# EAGLE design temp_display (EAGLE 6.2)
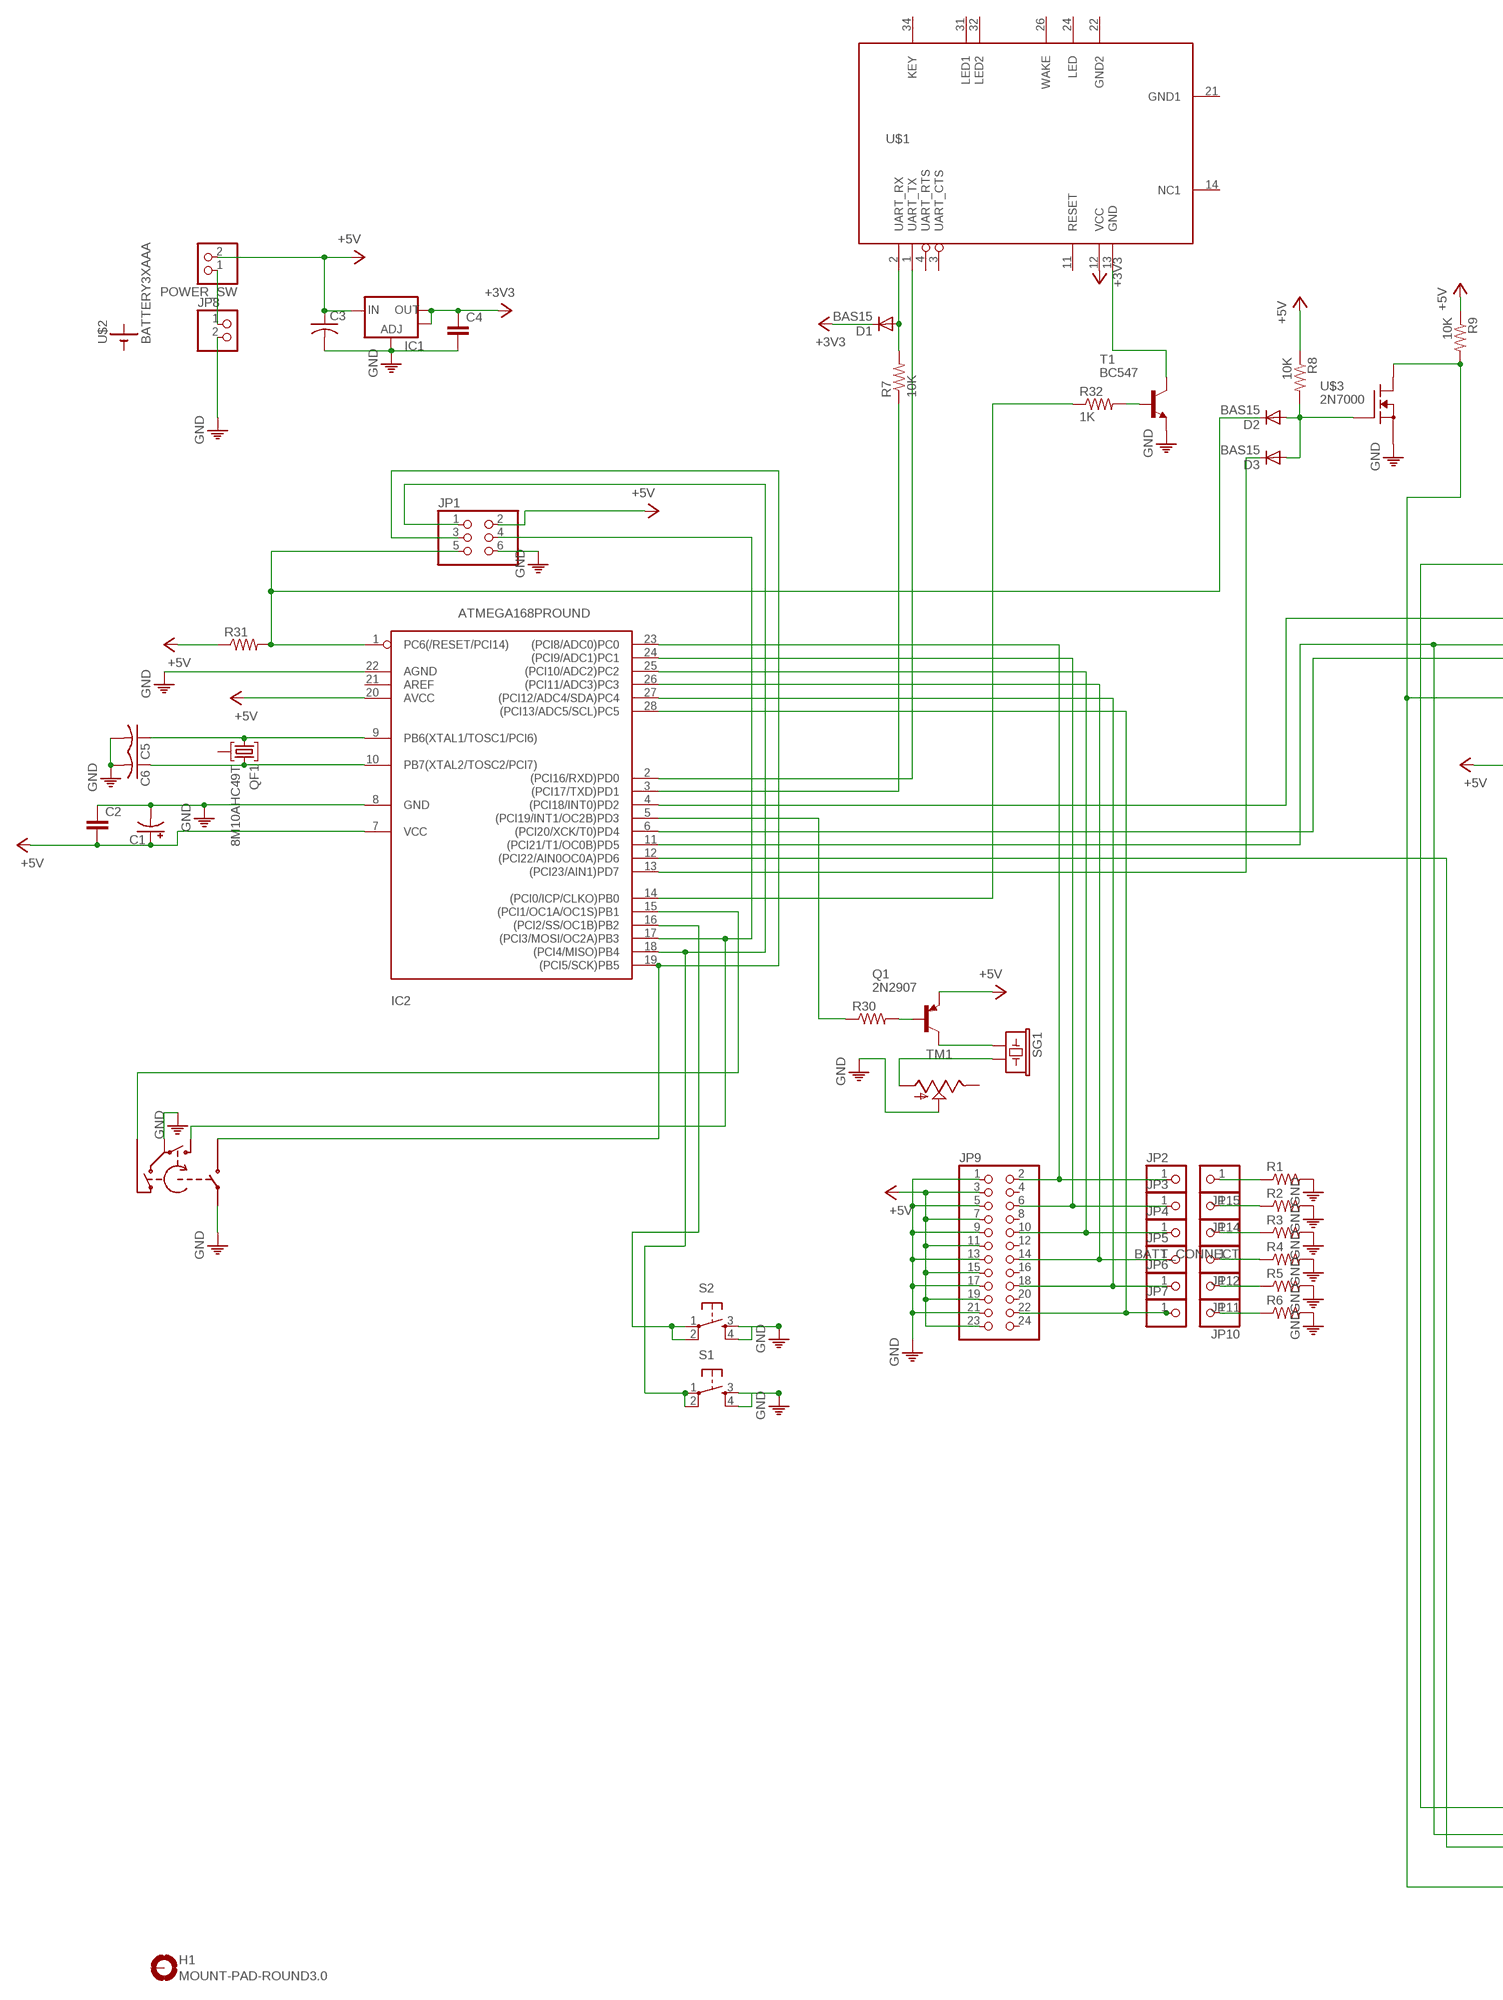
[diagram p0: schematic, sheet 1, part 1 of 2]
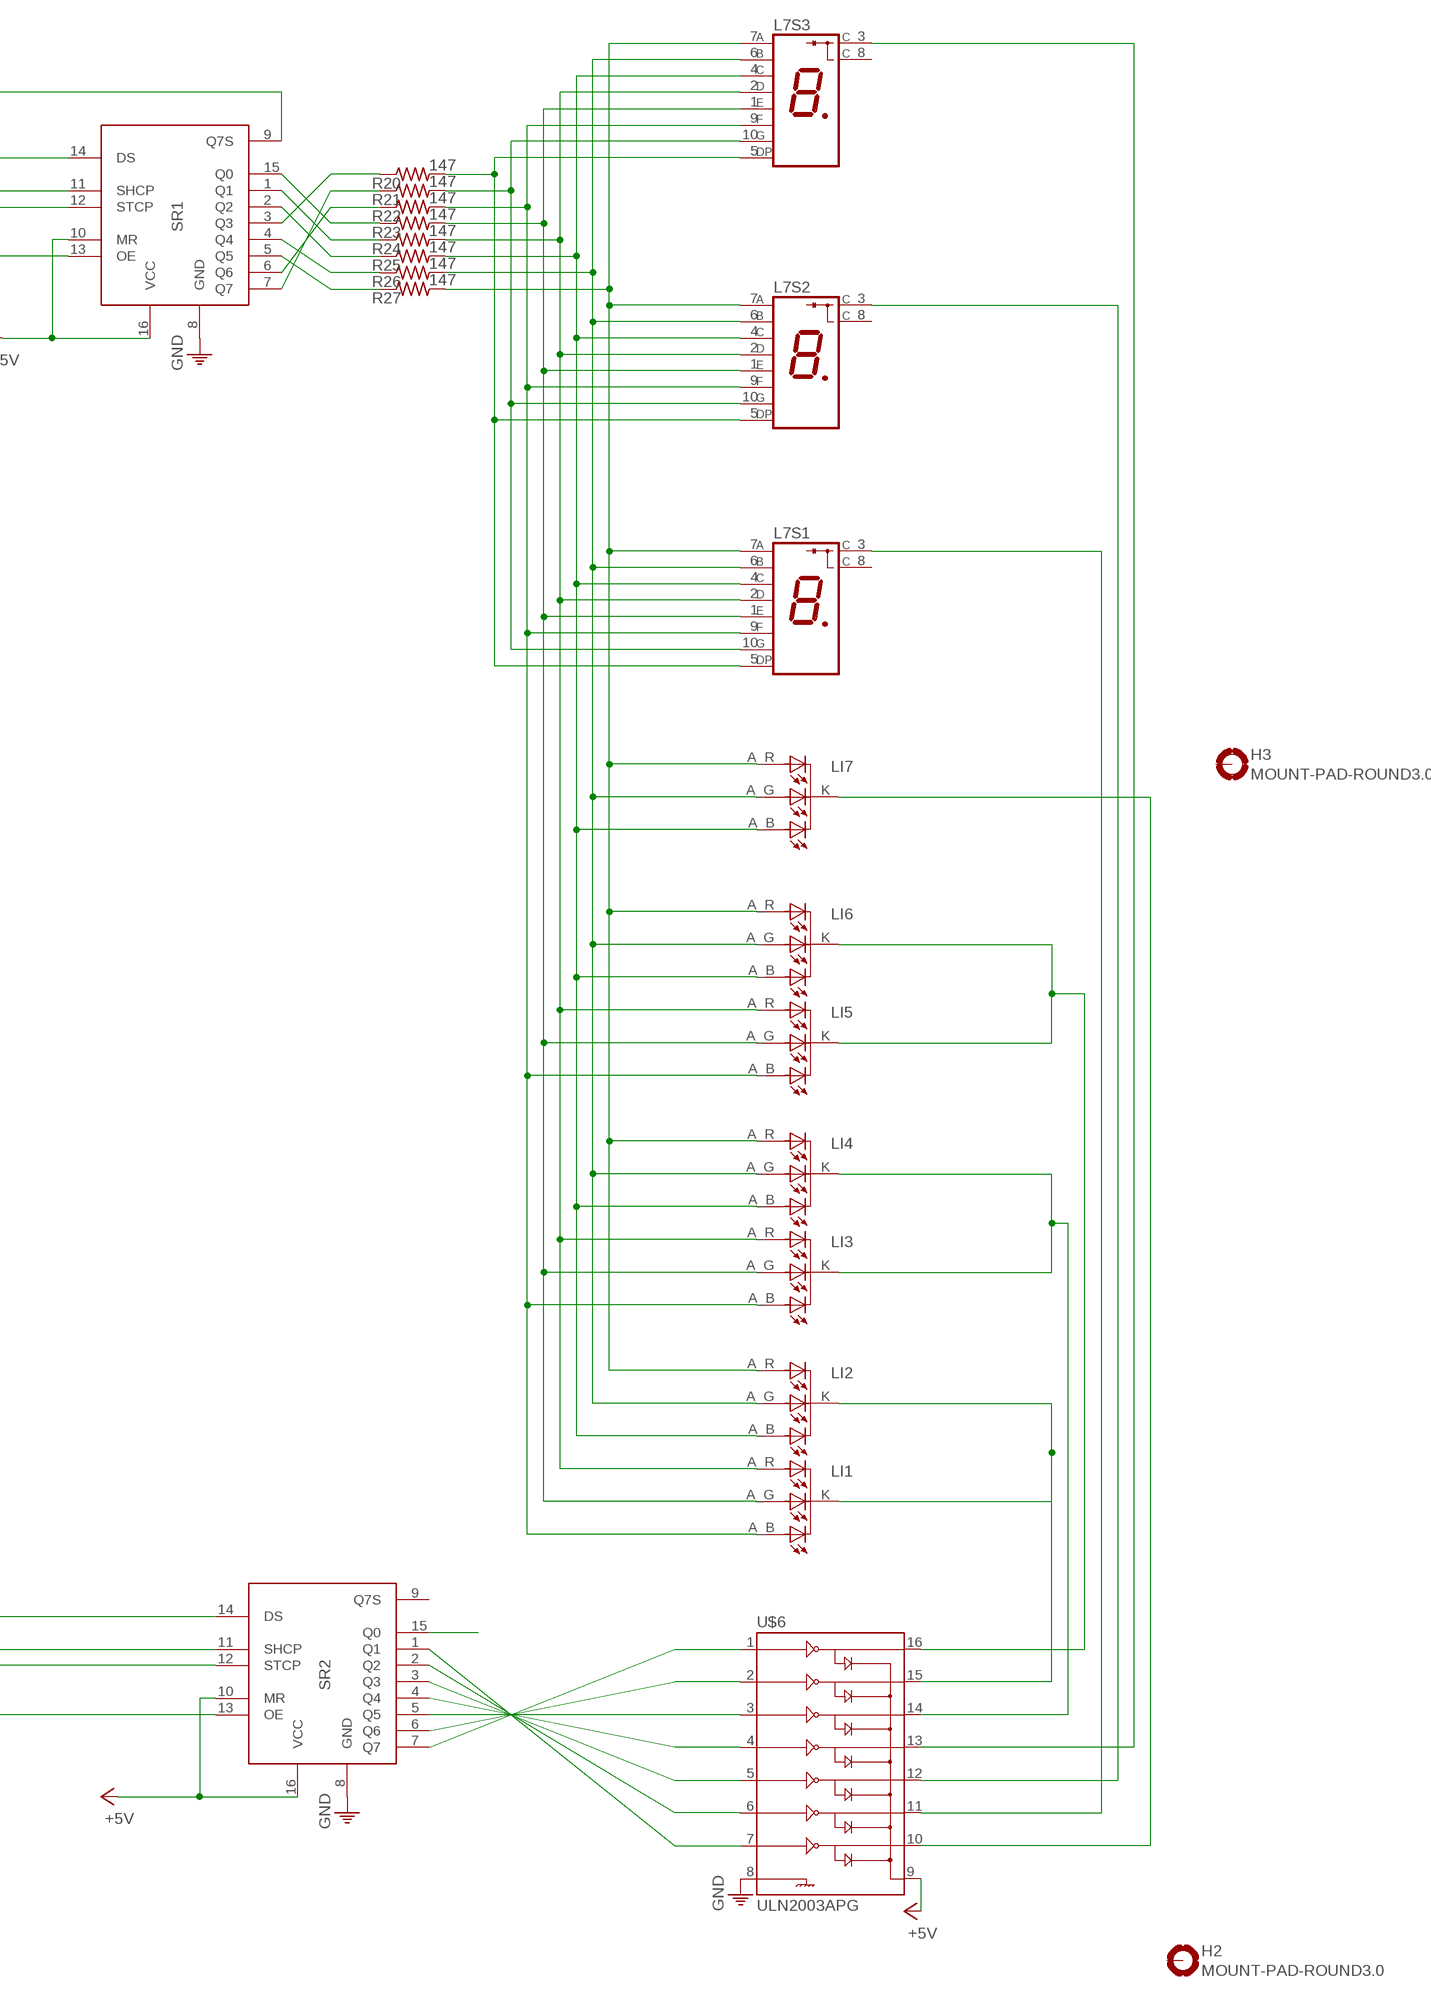
[diagram p1: schematic, sheet 1, part 2 of 2]

## Parts
BATT_CONNECT  PINHD-1X1  [1X01]
C1  CPOL-USE2.5-5  [E2,5-5]
C2  CAPPTH1  [CAP-PTH-5MM]
C3  C-US050-025X075  [C050-025X075]
C4  CAPSMD  [GRM43D]
C5  C-US025-024X044  [C025-024X044]
C6  C-US025-024X044  [C025-024X044]
D1  BAS15  [DO34-7]
D2  BAS15  [DO34-7]
D3  BAS15  [DO34-7]
H1  MOUNT-PAD-ROUND3.0  [3,0-PAD]
H2  MOUNT-PAD-ROUND3.0  [3,0-PAD]
H3  MOUNT-PAD-ROUND3.0  [3,0-PAD]
IC1  V_REG_LM1117SOT223  [SOT223]
IC2  ATMEGA168PROUND  [DIL28-3-ROUND]
JP1  PINHD-2X3  [2X03]
JP2  PINHD-1X1  [1X01]
JP3  PINHD-1X1  [1X01]
JP4  PINHD-1X1  [1X01]
JP5  PINHD-1X1  [1X01]
JP6  PINHD-1X1  [1X01]
JP7  PINHD-1X1  [1X01]
JP8  PINHD-1X2  [1X02]
JP9  PINHD-2X12  [2X12]
JP10  PINHD-1X1  [1X01]
JP11  PINHD-1X1  [1X01]
JP12  PINHD-1X1  [1X01]
JP14  PINHD-1X1  [1X01]
JP15  PINHD-1X1  [1X01]
L7S1  7-SEGMENT_LED_CCED_C.BA_FG  [7-SEGMENT_LED]
L7S2  7-SEGMENT_LED_CCED_C.BA_FG  [7-SEGMENT_LED]
L7S3  7-SEGMENT_LED_CCED_C.BA_FG  [7-SEGMENT_LED]
LI1  LED_RGB_CC  [LED_RGB_5MM_]
LI2  LED_RGB_CC  [LED_RGB_5MM_]
LI3  LED_RGB_CC  [LED_RGB_5MM_]
LI4  LED_RGB_CC  [LED_RGB_5MM_]
LI5  LED_RGB_CC  [LED_RGB_5MM_]
LI6  LED_RGB_CC  [LED_RGB_5MM_]
LI7  LED_RGB_CC  [LED_RGB_5MM_]
POWER_SW  PINHD-1X2  [1X02]
Q1  2N2907  [TO92-EBC-OVAL]
QF1  8M10AHC49T  [HC49U]
R1  R-USR_POWER-15X8.5  [R_POWER-15X8.5]
R2  R-USR_POWER-15X8.5  [R_POWER-15X8.5]
R3  R-USR_POWER-15X8.5  [R_POWER-15X8.5]
R4  R-USR_POWER-15X8.5  [R_POWER-15X8.5]
R5  R-USR_POWER-15X8.5  [R_POWER-15X8.5]
R6  R-USR_POWER-15X8.5  [R_POWER-15X8.5]
R7  10K  R-US_0204/7  [0204/7]
R8  10K  R-US_0204/2V  [0204V]
R9  10K  R-US_0204/2V  [0204V]
R20  147  R-US_0204/7  [0204/7]
R21  147  R-US_0204/7  [0204/7]
R22  147  R-US_0204/7  [0204/7]
R23  147  R-US_0204/7  [0204/7]
R24  147  R-US_0204/7  [0204/7]
R25  147  R-US_0204/7  [0204/7]
R26  147  R-US_0204/7  [0204/7]
R27  147  R-US_0204/7  [0204/7]
R30  R-US_0204/2V  [0204V]
R31  R-US_0204/5  [0204/5]
R32  1K  R-US_0204/7  [0204/7]
S1  TAC_SWITCHPTH  [TACTILE-PTH]
S2  TAC_SWITCHPTH  [TACTILE-PTH]
SG1  BUZZERPTH  [BUZZER-12MM]
SR1  74HC595  [DIL16]
SR2  74HC595  [DIL16]
T1  BC547  [TO92]
TM1  TRIMPOT  [TRIMPOT_A]
U$1  BLUETOOTH_MODULE_DX_FEWPADS  [BLUETOOTH_MODULE_DX_FEW_PADS]
U$2  BATTERY3XAAA  [BATTERY_HOLDER_3XAAA]
U$3  2N7000  [TO-92]
U$5  ALPHA-ROT-ENCODER  [TW-700198]
U$6  ULN2003APG  [DIL16]

## Nets
+3V3: C4.A D1.C IC1.2(OUT) IC1.4(OUT) U$1.12(VCC)
+5V: C1.+ C2.2 C3.1 IC1.3(IN) IC2.7(VCC) IC2.20(AVCC) JP1.2 JP9.3 JP9.7 JP9.11 JP9.15 JP9.19 JP9.23 POWER_SW.2 Q1.E R8.1 R9.1 R31.1 SR1.10(MR) SR1.16(VCC) SR2.10(MR) SR2.16(VCC) U$6.9
ADC0: IC2.23((PCI8/ADC0)PC0) JP2.1 JP9.2
ADC1: IC2.24((PCI9/ADC1)PC1) JP3.1 JP9.6
ADC2: IC2.25((PCI10/ADC2)PC2) JP4.1 JP9.10
ADC3: IC2.26((PCI11/ADC3)PC3) JP5.1 JP9.14
ADC4: IC2.27((PCI12/ADC4/SDA)PC4) JP6.1 JP9.18
ADC5: IC2.28((PCI13/ADC5/SCL)PC5) JP7.1 JP9.22
BTH_PW_TRANS: IC2.14((PCI0/ICP/CLKO)PB0) R32.1
CAT_1: SR2.1(Q1) U$6.7
CAT_2: SR2.2(Q2) U$6.6
CAT_3: SR2.3(Q3) U$6.5
CAT_4: SR2.4(Q4) U$6.4
CAT_5: SR2.5(Q5) U$6.3
CAT_6: SR2.6(Q6) U$6.2
CAT_7: SR2.7(Q7) U$6.1
DS: IC2.4((PCI18/INT0)PD2) SR1.14(DS)
GND: C1.- C2.1 C3.2 C4.C C5.2 C6.2 IC1.1(ADJ) IC2.8(GND) IC2.22(AGND) JP1.6 JP8.2 JP9.1 JP9.5 JP9.9 JP9.13 JP9.17 JP9.21 R1.P$2 R2.P$2 R3.P$2 R4.P$2 R5.P$2 R6.P$2 S1.3 S1.4 S2.3 S2.4 SR1.8(GND) SR2.8(GND) T1.1(E) TM1.S U$3.1(S) U$5.P2(COM) U$5.P4(S1) U$6.8
K_IL12: LI1.K LI2.K U$6.15
K_IL34: LI3.K LI4.K U$6.14
K_IL567: LI5.K LI6.K U$6.16
K_L7S_1: L7S1.3(C) U$6.11
K_L7S_2: L7S2.3(C) U$6.12
K_L7S_3: L7S3.3(C) U$6.13
MROUTE: IC2.19((PCI5/SCK)PB5) JP1.3 U$5.P5(S2)
N$1: SR1.9(Q7S) SR2.14(DS)
N$2: R32.2 T1.2(B)
N$3: T1.3(C) U$1.13(GND)
N$4: D1.A R7.2 U$1.2(UART_RX)
N$5: IC2.16((PCI2/SS/OC1B)PB2) S2.1 S2.2
N$6: SG1.- TM1.A
N$7: LI7.K U$6.10
N$9: SR2.15(Q0)
N$10: IC2.5((PCI19/INT1/OC2B)PD3) R30.1
N$11: C5.1 IC2.9(PB6(XTAL1/TOSC1/PCI6)) QF1.1
N$12: C6.1 IC2.10(PB7(XTAL2/TOSC2/PCI7)) QF1.3
N$13: D3.C IC2.13((PCI23/AIN1)PD7)
N$14: D2.A D3.A R8.2 U$3.2(G)
N$15: R20.1 SR1.3(Q3)
N$16: JP8.1 POWER_SW.1
N$18: R26.1 SR1.4(Q4)
N$22: R25.1 SR1.2(Q2)
N$23: JP15.1 R1.P$1
N$24: JP14.1 R2.P$1
N$25: R24.1 SR1.1(Q1)
N$26: R23.1 SR1.15(Q0)
N$27: IC2.18((PCI4/MISO)PB4) JP1.1 S1.1 S1.2
N$31: IC2.17((PCI3/MOSI/OC2A)PB3) JP1.4 U$5.P1(B)
N$35: BATT_CONNECT.1 R3.P$1
N$36: JP12.1 R4.P$1
N$37: JP11.1 R5.P$1
N$38: JP10.1 R6.P$1
N$40: R27.1 SR1.5(Q5)
N$41: IC2.15((PCI1/OC1A/OC1S)PB1) U$5.P3(A)
N$42: R21.1 SR1.7(Q7)
N$44: R22.1 SR1.6(Q6)
N$51: Q1.B R30.2
N$52: Q1.C SG1.+
OE: R9.2 SR1.13(OE) SR2.13(OE) U$3.3(D)
RESET: D2.C IC2.1(PC6(/RESET/PCI14)) JP1.5 R31.2
SEG_A: L7S1.7(SEG_A) L7S2.7(SEG_A) L7S3.7(SEG_A) LI2.A_R(R) LI4.A_R(R) LI6.A_R(R) LI7.A_R(R) R27.2
SEG_B: L7S1.6(SEG_B) L7S2.6(SEG_B) L7S3.6(SEG_B) LI2.A_G(G) LI4.A_G(G) LI6.A_G(G) LI7.A_G(G) R26.2
SEG_C: L7S1.4(SEG_C) L7S2.4(SEG_C) L7S3.4(SEG_C) LI2.A_B(B) LI4.A_B(B) LI6.A_B(B) LI7.A_B(B) R25.2
SEG_D: L7S1.2(SEG_D) L7S2.2(SEG_D) L7S3.2(SEG_D) LI1.A_R(R) LI3.A_R(R) LI5.A_R(R) R24.2
SEG_DP: L7S1.5(SEG_DP) L7S2.5(SEG_DP) L7S3.5(SEG_DP) R20.2
SEG_E: L7S1.1(SEG_E) L7S2.1(SEG_E) L7S3.1(SEG_E) LI1.A_G(G) LI3.A_G(G) LI5.A_G(G) R23.2
SEG_F: L7S1.9(SEG_F) L7S2.9(SEG_F) L7S3.9(SEG_F) LI1.A_B(B) LI3.A_B(B) LI5.A_B(B) R22.2
SEG_G: L7S1.10(SEG_G) L7S2.10(SEG_G) L7S3.10(SEG_G) R21.2
SERIAL_RX: IC2.3((PCI17/TXD)PD1) R7.1
SERIAL_TX: IC2.2((PCI16/RXD)PD0) U$1.1(UART_TX)
SHCP: IC2.11((PCI21/T1/OC0B)PD5) SR1.11(SHCP) SR2.11(SHCP)
STCP1: IC2.6((PCI20/XCK/T0)PD4) SR1.12(STCP)
STCP2: IC2.12((PCI22/AIN0OC0A)PD6) SR2.12(STCP)
Unconnected: H1.B3,0(MOUNT) H2.B3,0(MOUNT) H3.B3,0(MOUNT) IC2.21(AREF) JP9.4 JP9.8 JP9.12 JP9.16 JP9.20 JP9.24 L7S1.8(C) L7S2.8(C) L7S3.8(C) QF1.2 SR2.9(Q7S) TM1.E U$1.3(UART_CTS) U$1.4(UART_RTS) U$1.11(RESET) U$1.14(NC1) U$1.24(LED) U$1.26(WAKE) U$1.31(LED1) U$1.32(LED2) U$1.34(KEY)

## Power pins joined to a net without a drawn wire
GND1: U$1.21(GND1)
GND2: U$1.22(GND2)

## Library data of the parts
BATT_CONNECT JP2-JP7 JP10-JP12 JP14 JP15 = adafruit:PINHD-1X1: Pin header 1x1 for 0.1" spacing With round pins
C1 = adafruit:CPOL-US: POLARIZED CAPACITOR, American symbol
C2 C4 = SparkFun:CAP: Capacitor Standard 0603 ceramic capacitor, and 0.1" leaded capacitor.
C3 = adafruit:C-US: CAPACITOR, American symbol
C5 C6 = resistor:C-US: CAPACITOR, American symbol
D1-D3 = diode:BAS15: DIODE high speed
H1-H3 = holes:MOUNT-PAD-ROUND: MOUNTING PAD, round
IC1 = SparkFun:V_REG_LM1117: Voltage Regulator LM1117 Standard adjustable voltage regulator but in SMD form. Spark Fun Electronics SKU : COM-00595
IC2 = adafruit:ATMEGA168*P: MICROCONTROLLER 16 kBytes FLASH 1 kBytes SRAM 512 Bytes EEPROM USART 8-channel 10 bit ADC
JP1 = pinhead:PINHD-2X3: PIN HEADER
JP8 POWER_SW = pinhead:PINHD-1X2: PIN HEADER
JP9 = pinhead:PINHD-2X12: PIN HEADER
L7S1-L7S3 = kirill:7-SEGMENT_LED_CC
LI1-LI7 = kirill:LED_RGB_CC
Q1 = adafruit:2N2907*: PNP Transistor Big Oval pads
QF1 = crystal:8M10AHC49T: Monolithic Crystal Filters Source: www.vanlong.com; OC_FARNELL: unknown; OC_NEWARK: unknown
R1-R6 = kirill:R-US
R7-R9 R20-R27 R30-R32 = resistor:R-US_: RESISTOR, American symbol
S1 S2 = SparkFun:TAC_SWITCH: Momentary Switch Button commonly used for reset or general input. Spark Fun Electronics SKU : COM-00097
SG1 = SparkFun:BUZZER: Buzzer 12mm Spark Fun Electronics SKU : Comp-Buzzer
SR1 SR2 = kirill:74HC595
T1 = transistor:BC547: NPN TRANSISTOR
TM1 = kirill:TRIMPOT
U$1 = kirill:BLUETOOTH_MODULE_DX_FEWPADS
U$2 = kirill:BATTERY
U$3 = kirill:2N7000
U$5 = RotaryEncoder:ALPHA-ROT-ENCODER
U$6 = kirill:ULN2003APG

## Board
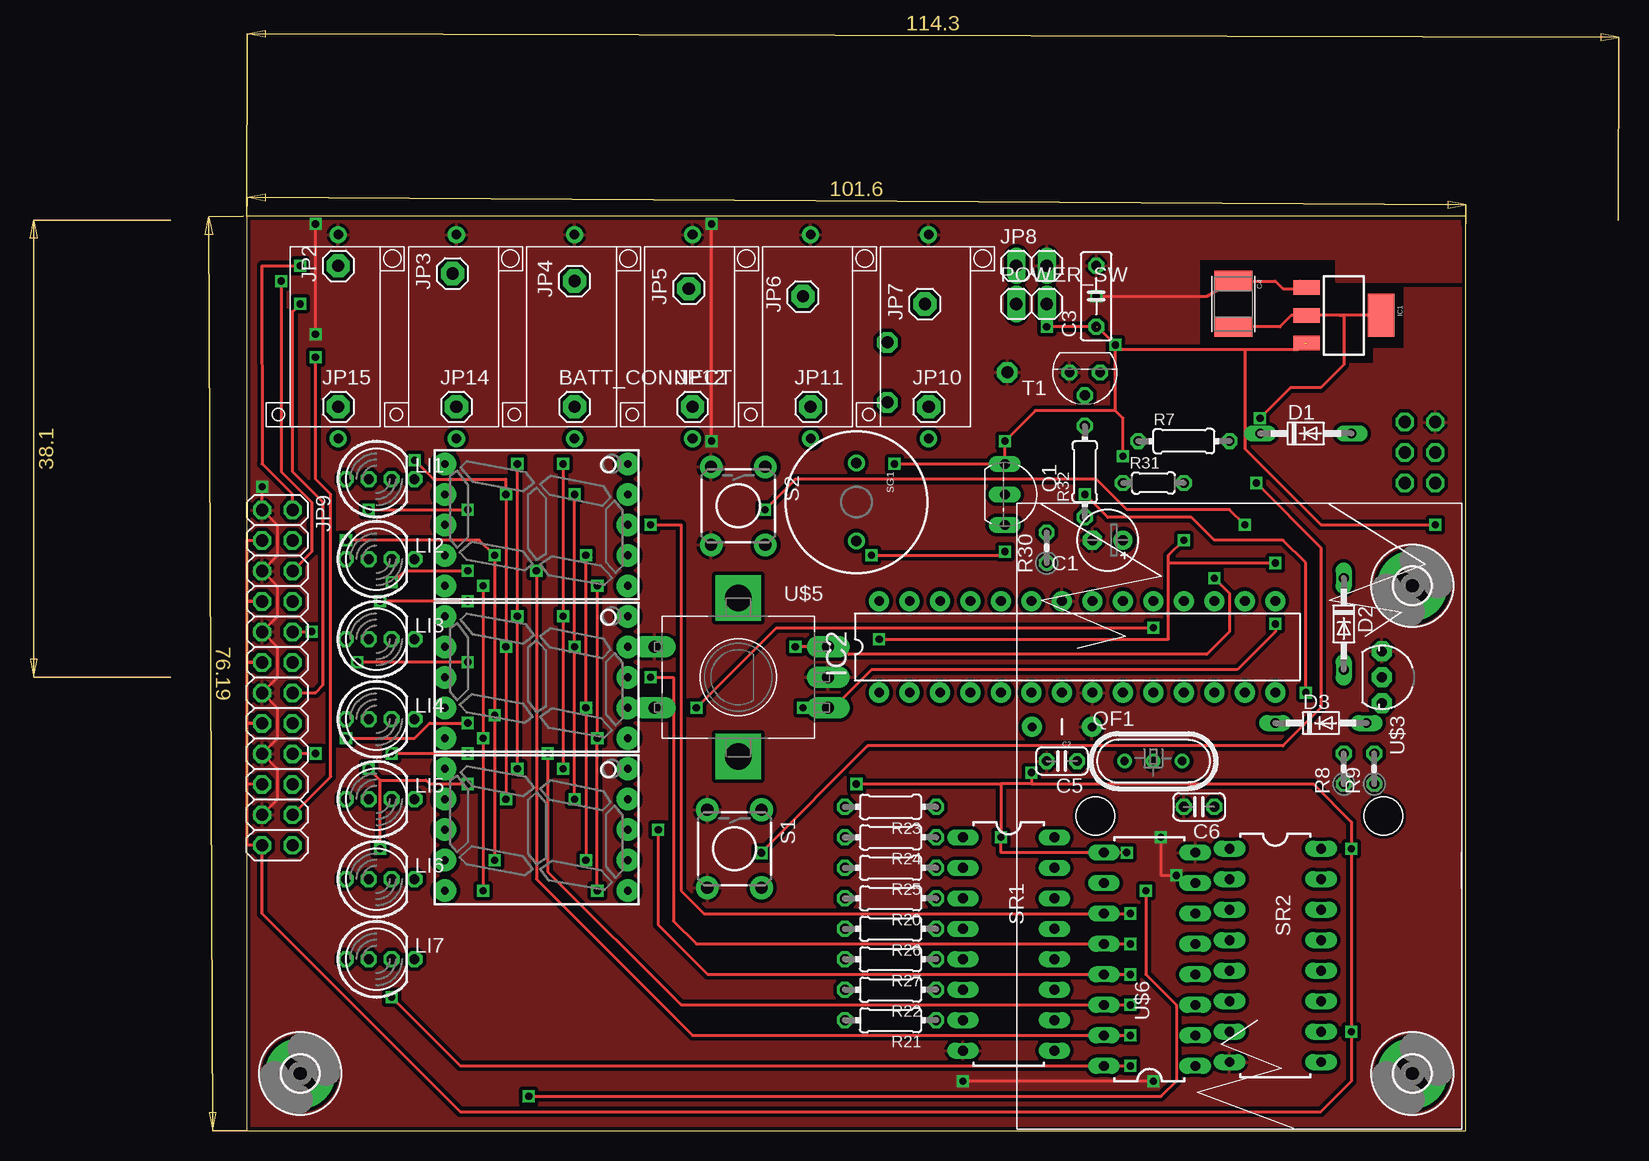
[diagram p2: board, top side]
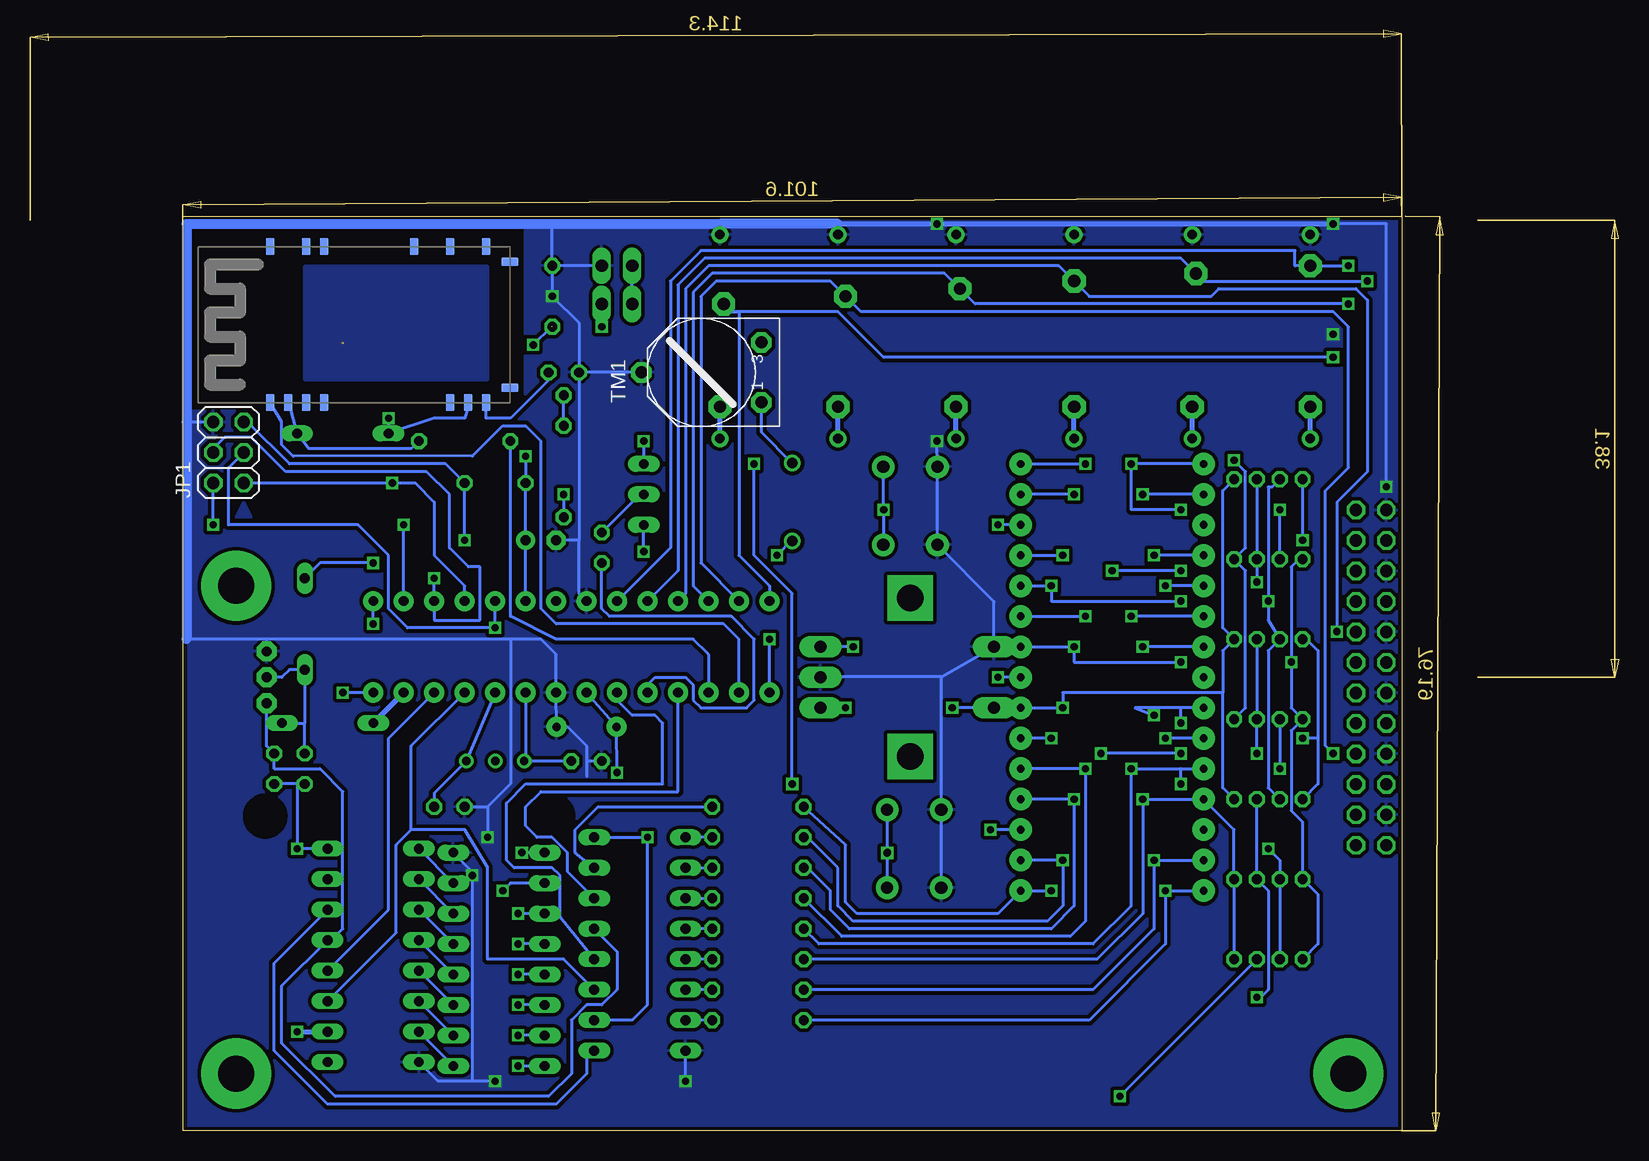
[diagram p3: board, bottom side, seen from below]

Size 101.59 x 76.19 mm. Coordinates in mm from the lower left corner, seen from the top.
Outline: 0,0 101.59,0 101.59,76.19 0,76.19 0,0
Copper layers (1*16): Top 0.035mm / dielectric 1.5mm / Bottom 0.035mm
Design rules: minimum track width 10mil, minimum drill 23mil, track to track 5mil, track to pad 7mil, pad to pad 5mil, via to via 5mil, smd to smd 5mil, copper to edge 10mil, drill to drill 8mil, minimum pad ring 10mil, minimum via ring 8mil, stop-mask expansion 4mil, vias tented up to drill 0mil, thermal gap 10mil

### Footprints (pad centres in the part's own frame; a part is rotated, then mirrored left to right if it is on the bottom)
1X01 = drill 1.016 pad 1.93 octagon: 1 0,0
E2,5-5 = drill 0.813 pad 1.6: + -1.27,0 | drill 0.813 pad 1.6 octagon: - 1.27,0
CAP-PTH-5MM = drill 0.7 pad 1.651: 1 -2.5,0; 2 2.5,0
C050-025X075 = drill 0.813 octagon: 1 -2.54,0; 2 2.54,0
GRM43D = smd 1.65 x 3.2: A 1.927,0; C -1.927,0
C025-024X044 = drill 0.813 octagon: 1 -1.27,0; 2 1.27,0
DO34-7 = drill 0.813 long: A 3.81,0; C -3.81,0
3,0-PAD = drill 3 pad 5.842: B3,0 0,0
SOT223 = smd 1.219 x 2.235: 1 -2.311,-3.099; 2 0,-3.099; 3 2.311,-3.099 | smd 3.6 x 2.2: 4 0,3.099
DIL28-3-ROUND = drill 0.813 pad 1.676: 1 -16.51,-3.81; 2 -13.97,-3.81; 3 -11.43,-3.81; 4 -8.89,-3.81; 5 -6.35,-3.81; 6 -3.81,-3.81; 7 -1.27,-3.81; 8 1.27,-3.81; 9 3.81,-3.81; 10 6.35,-3.81; 11 8.89,-3.81; 12 11.43,-3.81; 13 13.97,-3.81; 14 16.51,-3.81; 15 16.51,3.81; 16 13.97,3.81; 17 11.43,3.81; 18 8.89,3.81; 19 6.35,3.81; 20 3.81,3.81; 21 1.27,3.81; 22 -1.27,3.81; 23 -3.81,3.81; 24 -6.35,3.81; 25 -8.89,3.81; 26 -11.43,3.81; 27 -13.97,3.81; 28 -16.51,3.81
2X03 = drill 1.016 octagon: 1 -2.54,-1.27; 2 -2.54,1.27; 3 0,-1.27; 4 0,1.27; 5 2.54,-1.27; 6 2.54,1.27
1X02 = drill 1.016 long: 1 -1.27,0; 2 1.27,0
2X12 = drill 1.016 octagon: 1 -13.97,-1.27; 2 -13.97,1.27; 3 -11.43,-1.27; 4 -11.43,1.27; 5 -8.89,-1.27; 6 -8.89,1.27; 7 -6.35,-1.27; 8 -6.35,1.27; 9 -3.81,-1.27; 10 -3.81,1.27; 11 -1.27,-1.27; 12 -1.27,1.27; 13 1.27,-1.27; 14 1.27,1.27; 15 3.81,-1.27; 16 3.81,1.27; 17 6.35,-1.27; 18 6.35,1.27; 19 8.89,-1.27; 20 8.89,1.27; 21 11.43,-1.27; 22 11.43,1.27; 23 13.97,-1.27; 24 13.97,1.27
7-SEGMENT_LED = drill 0.65 pad 1.88: 1 -5.08,-7.62; 2 -2.54,-7.62; 3 0,-7.62; 4 2.54,-7.62; 5 5.08,-7.62; 6 5.08,7.62; 7 2.54,7.62; 8 0,7.62; 9 -2.54,7.62; 10 -5.08,7.62
LED_RGB_5MM_ = drill 0.813 octagon: A_B -5.08,0; A_G -3.175,0; A_R 0.635,0; K -1.27,0
TO92-EBC-OVAL = drill 0.813 long: B 0,-1.27; C 2.54,-1.27; E -2.54,-1.27
HC49U = drill 0.7 pad 1.2: 1 -2.413,0; 2 -0.027,0; 3 2.413,0
R_POWER-15X8.5 = drill 0.8 pad 1.422: P$1 -9,0; P$2 8,0
0204/7 = drill 0.813 octagon: 1 -3.81,0; 2 3.81,0
0204V = drill 0.813 octagon: 1 -1.27,0; 2 1.27,0
0204/5 = drill 0.813 octagon: 1 -2.54,0; 2 2.54,0
TACTILE-PTH = drill 1.016 pad 1.88: 1 -3.251,2.261; 2 3.251,2.261; 3 -3.251,-2.261; 4 3.251,-2.261
BUZZER-12MM = drill 0.9: + 3.25,0; - -3.25,0
DIL16 = drill 0.813 long: 1 -8.89,-3.81; 2 -6.35,-3.81; 3 -3.81,-3.81; 4 -1.27,-3.81; 5 1.27,-3.81; 6 3.81,-3.81; 7 6.35,-3.81; 8 8.89,-3.81; 9 8.89,3.81; 10 6.35,3.81; 11 3.81,3.81; 12 1.27,3.81; 13 -1.27,3.81; 14 -3.81,3.81; 15 -6.35,3.81; 16 -8.89,3.81
TO92 = drill 0.813 octagon: 1 1.27,0; 2 0,1.905; 3 -1.27,0
TRIMPOT_A = drill 1 pad 1.676 octagon: A -2.5,-2.5; E 2.5,-2.5; S 0,7.5
BLUETOOTH_MODULE_DX_FEW_PADS = smd 0.711 x 1.422: 1 -8.29,-6; 2 -6.79,-6; 3 -5.29,-6; 4 -3.79,-6; 11 6.71,-6; 12 8.21,-6; 13 9.71,-6; 22 9.71,7; 24 6.71,7; 26 3.71,7; 31 -3.79,7; 32 -5.29,7; 34 -8.29,7 | smd 1.422 x 0.711: 14 11.71,-4.75; 21 11.71,5.75
TO-92 = drill 0.813 pad 1.676 octagon: 1 -2.159,0; 2 0,0; 3 2.159,0
TW-700198 = drill 2.2 pad 3.81 square: NC1 0,6.604; NC2 0,-6.604 | drill 1 pad 1.778 long: P1 7.493,2.54; P2 7.493,0; P3 7.493,-2.54; P4 -6.985,2.54; P5 -6.985,-2.54

### Placement (x,y rotation side)
BATT_CONNECT  27.3,60.33 0 top
C1  71.75,49.21 180 top
C2  67.94,33.66 180 top
C3  70.8,69.53 90 top
C4  82.23,68.9 270 top
C5  67.94,30.8 180 top
C6  79.38,26.99 180 top
D1  88.27,58.1 0 top
D2  91.44,42.23 270 top
D3  89.53,33.97 0 top
H1  97.16,4.76 0 top
H2  4.45,4.76 0 top
H3  97.16,45.4 0 top
IC1  91.44,67.95 270 top
IC2  69.22,40.32 0 top
JP1  97.79,56.52 90 bottom
JP2  7.62,72.07 90 top
JP3  17.14,71.44 90 top
JP4  27.3,70.8 90 top
JP5  36.83,70.17 90 top
JP6  46.35,69.53 90 top
JP7  56.52,68.9 90 top
JP8  65.41,72.07 0 top
JP9  2.54,37.75 270 top
JP10  56.83,60.33 0 top
JP11  46.99,60.33 0 top
JP12  37.15,60.33 0 top
JP14  17.46,60.33 0 top
JP15  7.62,60.33 0 top
L7S1  24.13,50.48 90 top
L7S2  24.13,37.78 90 top
L7S3  24.13,25.08 90 top
LI1  13.34,54.29 0 top
LI2  13.34,47.63 0 top
LI3  13.34,40.96 0 top
LI4  13.34,34.29 0 top
LI5  13.34,27.62 0 top
LI6  13.34,20.96 0 top
LI7  13.34,14.29 0 top
POWER_SW  65.41,68.9 0 top
Q1  64.45,53.02 270 top
QF1  75.56,30.8 0 top
R1  7.62,66.68 90 top
R2  17.46,66.68 90 top
R3  27.3,66.68 90 top
R4  37.15,66.68 90 top
R5  46.99,66.68 90 top
R6  56.83,66.68 90 top
R7  78.11,57.47 0 top
R8  91.44,30.16 90 top
R9  93.98,30.16 90 top
R20  53.66,19.37 180 top
R21  53.66,9.21 180 top
R22  53.66,11.75 180 top
R23  53.66,26.99 180 top
R24  53.66,24.45 180 top
R25  53.66,21.91 180 top
R26  53.66,16.83 180 top
R27  53.66,14.29 180 top
R30  66.67,48.58 90 top
R31  75.56,53.98 0 top
R32  69.85,54.93 90 top
S1  40.64,23.5 270 top
S2  40.96,52.07 270 top
SG1  50.8,52.39 270 top
SR1  63.5,15.56 270 top
SR2  85.72,14.61 270 top
T1  69.85,63.18 180 top
TM1  55.88,63.18 90 bottom
U$1  86.04,66.68 0 bottom
U$2  82.23,29.21 180 top
U$3  94.61,37.78 270 top
U$5  40.96,37.78 0 top
U$6  75.25,14.29 90 top

### Tracks (layer width: path | path; a pad name or v marks a point on that pad's centre or on a via)
+3V3  (via drill 0.6)
  Top 0.254: C4.A arc42 82.55,66.99 86.12,66.99 87.07,67.94 IC1.2 91.11,67.94 | IC1.4 91.11,67.94 | 91.11,67.94 91.44,67.96 91.44,63.82 89.53,61.91 87,61.91 v84.45,59.37
  Bottom 0.254: U$1.12 77.83,60.28 78.11,59.37 80.64,59.37 D1.C v84.45,59.37
+5V  (via drill 0.6)  (2 unrouted)
  Top 0.254: JP9.3 0.03,49.18 0,49.21 0,44.13 1.24,44.13 JP9.7 0,44.1 0,39.05 1.27,39.05 JP9.11 0,39.02 0,33.97 1.27,33.97 JP9.15 0,33.94 0,28.89 1.27,28.89 JP9.19 0,28.86 0,23.81 1.27,23.81 JP9.23 1.27,18.1 17.78,1.59 89.53,1.59 92.08,4.13 v92.08,8.26 v92.08,23.5 92.08,25.72 88.9,28.89 65.41,28.89 | v73.34,23.18 U$6.9 62.87,23.18 v62.87,24.45 62.87,28.89 | 88.18,65.63 87.63,65.09 83.19,65.09 | 83.19,65.09 72.39,65.09 | 72.39,65.09 v72.39,65.48 70.88,66.99 v66.67,66.99 | 72.39,60.01 73.03,59.37 v73.03,56.2 | 72.39,60.01 72.39,60.64 72.39,65.09 | 72.39,60.01 65.72,60.01 v63.18,57.47 Q1.E v53.98,55.56 | 83.19,65.09 83.19,56.83 89.53,50.48 v99.06,50.48 | v65.41,29.85 65.41,28.89 | 65.41,28.89 62.87,28.89 | v50.8,28.89 62.87,28.89
  Bottom 0.254: U$6.9 v73.34,23.18 | 89.53,23.81 SR2.16 v92.08,23.5 92.08,28.89 | v63.18,57.47 Q1.E | v72.39,65.48 70.88,66.99 | v65.41,29.85 C2.2 IC2.7 | v50.8,28.89 50.8,44.77 53.98,47.94 v53.98,55.56 | SR1.10 64.14,9.21 62.87,10.48 v62.87,24.45 SR1.16 | IC2.20 C1.+ R31.1 v73.03,56.2 | v99.06,50.48 JP1.2 | R8.1 92.08,28.89 | 92.08,28.89 R9.1 | POWER_SW.2 v66.67,66.99
  Bottom 0.406: v92.08,8.26 SR2.10
ADC0  (via drill 0.6)
  Top 0.254: JP9.2 3.81,53.02 1.27,55.56 1.3,55.56 1.27,72.07 v4.45,72.07
  Bottom 0.254: IC2.23 60.96,48.58 60.96,70.8 58.42,73.34 8.89,73.34 8.89,72.07 JP2.1 v4.45,72.07
ADC1  (via drill 0.6)
  Top 0.254: 3.84,46.67 JP9.6 5.4,48.23 5.4,52.39 2.86,54.93 v2.86,70.8
  Bottom 0.254: IC2.24 60.33,46.67 60.33,70.49 58.1,72.71 18.41,72.71 JP3.1 16.51,70.8 v2.86,70.8
ADC2  (via drill 0.6)
  Top 0.254: JP9.10 3.84,41.59 v5.4,41.59
  Bottom 0.254: IC2.25 59.69,44.77 59.69,70.17 57.78,72.07 28.57,72.07 JP4.1 26.04,69.53 15.88,69.53 15.24,70.17 3.81,70.17 2.86,69.22 2.86,54.93 5.4,52.39 v5.4,41.59
ADC3  (via drill 0.6)
  Top 0.254: JP9.14 3.84,36.51 5.71,36.51 6.35,37.15 6.35,52.39 3.81,54.93 3.81,68.26 v4.45,68.9
  Bottom 0.254: IC2.26 59.05,45.4 59.05,69.85 57.47,71.44 38.1,71.44 JP5.1 35.56,68.9 v4.45,68.9
ADC4  (via drill 0.6)
  Top 0.254: JP9.18 3.84,31.43 v5.71,31.43
  Bottom 0.254: IC2.27 58.42,47.31 58.42,69.53 57.15,70.8 47.62,70.8 JP6.1 45.09,68.26 5.71,68.26 4.45,66.99 4.45,55.25 6.35,53.34 6.35,32.07 v5.71,31.43
ADC5  (via drill 0.6)
  Top 0.254: JP9.22 6.99,29.5 6.99,53.02 5.71,54.29 v5.71,64.45
  Bottom 0.254: 55.88,68.26 JP7.1 55.88,68.26 | 55.88,68.26 55.24,68.26 | 55.24,68.26 55.24,47.94 52.7,45.4 IC2.28 | v5.71,64.45 43.18,64.45 46.99,68.26 55.24,68.26 | 55.24,68.26 55.88,68.26
BTH_PW_TRANS  (via drill 0.6)
  Top 0.254: v88.27,36.51 88.27,47.31 86.36,49.21 80.64,49.21 78.74,51.12 71.75,51.12 v69.85,53.02
  Bottom 0.254: IC2.14 v88.27,36.51 | v69.85,53.02 R32.1
CAT_1
  Bottom 0.254: U$6.7 SR2.1
CAT_2
  Bottom 0.254: U$6.6 SR2.2
CAT_3
  Bottom 0.254: U$6.5 SR2.3
CAT_4
  Bottom 0.254: U$6.4 SR2.4
CAT_5
  Bottom 0.254: U$6.3 SR2.5
CAT_6
  Bottom 0.254: U$6.2 SR2.6
CAT_7
  Bottom 0.254: U$6.1 SR2.7
DS
  Bottom 0.254: SR1.14 69.53,21.59 69.53,23.18 70.8,24.45 72.07,24.45 73.03,25.4 73.03,26.99 71.75,28.26 60.33,28.26 IC2.4
GND  (via drill 0.6)
  Top 0.254: JP9.21 2.54,27.59 2.54,30.16 1.3,31.4 JP9.17 2.54,32.67 2.54,35.24 1.3,36.48 JP9.13 2.54,37.75 2.54,40.32 1.3,41.56 JP9.9 2.54,42.83 2.54,45.4 1.3,46.64 JP9.5 2.54,47.91 2.54,50.48 1.3,51.72 JP9.1 v1.27,53.66 | v70.8,69.53 80.01,69.53 C4.C 82.53,70.88 82.55,70.8 85.72,70.8 86.36,70.17 87.63,70.17 87.8,70.8 IC1.1 | v75.56,4.13 v59.69,4.13 | v76.2,24.45 76.2,21.27 v77.47,21.27 | v5.71,66.36 v5.71,75.57 | v38.73,57.47 v38.73,75.57
  Bottom 0.254: 74.33,75.53 74.3,75.57 | 76.33,75.43 76.2,75.57 | T1.1 68.58,49.21 | U$6.8 77.47,21.59 v77.47,21.27 77.47,4.13 | v75.56,4.13 77.47,4.13 | 77.47,4.13 80.33,4.13 SR2.8 | IC2.22 68.58,44.77 68.58,49.21 | R3.P$2 27.3,75.57 | v59.69,4.13 SR1.8 | 67.94,30.8 67.94,32.07 69.53,33.66 C2.1 IC2.8 70.48,39.69 71.75,40.96 74.3,40.96 | 67.94,30.8 67.94,29.53 | S1.4 S1.3 38.38,37.82 | 38.38,37.82 U$5.P4 33.97,44.09 S2.4 S2.3 v38.73,57.47 | 38.38,37.82 46.58,37.82 U$5.P2 | 8.26,75.57 v5.71,75.57 1.27,75.57 v1.27,53.66 | 74.3,40.96 94.61,40.96 | 94.61,40.96 101.28,40.96 | C3.2 70.8,75.25 69.85,75.57 | TM1.S T1.1 | C3.2 v70.8,69.53 68.58,67.31 T1.1 | 68.58,49.21 C1.- | JP1.6 101.28,59.05 | JP8.2 C3.2 | C6.2 76.2,26.99 | C5.2 67.94,30.8 | U$3.1 94.61,40.96 | 74.3,40.96 74.3,28.89 76.2,26.99 | 76.2,26.99 v76.2,24.45
  Bottom 0.406: 56.83,75.57 R6.P$2 | R5.P$2 46.99,75.57 v38.73,75.57 37.15,75.57 | R4.P$2 37.15,75.57 | 37.15,75.57 27.3,75.57 17.46,75.57 | R2.P$2 17.46,75.57 | 17.46,75.57 8.26,75.57 7.62,75.57 | 7.62,75.57 R1.P$2 | 7.62,75.57 v5.71,75.57
  Bottom 0.61: R6.P$2 56.83,74.61
  Bottom 0.813: 46.99,75.57 56.83,75.57 69.85,75.57 74.3,75.57 76.2,75.57 101.28,75.57 101.28,59.05 101.28,40.96
  pour Top (isolate 0.305): 0,76.2 0,0 101.6,0 101.6,70.17 96.52,70.17 96.52,65.09 93.98,65.09 93.98,63.82 79.38,63.82 79.38,72.71 90.81,72.71 90.81,70.8 101.6,70.8 101.6,76.2
  pour Bottom (isolate 0.305): 0,76.2 0,0 101.6,0 101.6,60.01 73.03,60.01 73.03,76.2
K_IL12  (via drill 0.6)
  Top 0.254: v12.06,45.72 13.34,46.67 v18.41,46.67 | v24.13,46.67 24.13,20.96 37.15,7.94 v73.66,7.94
  Bottom 0.254: v18.41,46.67 v24.13,46.67 | U$6.15 v73.66,7.94 | LI1.K LI2.K v12.06,45.72
K_IL34  (via drill 0.6)
  Top 0.254: v12.06,31.43 v18.41,31.43 | v25.08,31.43 25.08,21.59 36.2,10.48 v73.66,10.48
  Bottom 0.254: v18.41,31.43 v25.08,31.43 | U$6.14 v73.66,10.48 | v12.06,31.43 LI4.K LI3.K
K_IL567  (via drill 0.6)
  Top 0.254: v12.06,11.11 17.78,5.4 v73.66,5.4
  Bottom 0.254: v73.66,5.4 U$6.16 | LI5.K LI6.K 11.11,20 11.11,11.75 11.75,11.11 v12.06,11.11
K_L7S_1  (via drill 0.6)
  Top 0.254: v33.66,50.48 36.2,50.48 36.2,20 38.1,18.1 v73.66,18.1
  Bottom 0.254: L7S1.3 v33.66,50.48 | U$6.11 v73.66,18.1
K_L7S_2  (via drill 0.6)
  Top 0.254: v33.66,37.78 35.56,37.78 35.56,17.46 37.47,15.56 v73.66,15.56
  Bottom 0.254: L7S2.3 v33.66,37.78 | U$6.12 v73.66,15.56
K_L7S_3  (via drill 0.6)
  Top 0.254: v34.29,25.08 34.29,17.15 38.42,13.02 v73.66,13.02
  Bottom 0.254: L7S3.3 v34.29,25.08 | U$6.13 v73.66,13.02
MROUTE  (via drill 0.6)
  Top 0.254: v37.47,35.24 44.13,41.91 v75.56,41.91
  Bottom 0.254: U$5.P5 v37.47,35.24 | IC2.19 v75.56,41.91 82.87,41.91 84.45,43.5 84.45,47.94 87,50.48 97.79,50.48 97.79,55.25 JP1.3
N$1
  Bottom 0.254: SR1.9 67.94,6.03 67.94,4.76 70.48,2.22 89.53,2.22 93.98,6.67 93.98,13.97 SR2.14
N$2
  Bottom 0.254: R32.2 T1.2
N$3
  Bottom 0.254: U$1.13 76.33,59.37 74.3,59.37 71.12,62.55 T1.3
N$4
  Bottom 0.254: U$1.2 92.71,60.55 D1.A 91.12,56.83 82.55,56.83 R7.2
N$5  (via drill 0.6)
  Top 0.254: v83.19,50.48 81.92,51.75 73.34,51.75 70.8,54.29 45.72,54.29 v43.18,51.75
  Bottom 0.254: IC2.16 v83.19,50.48 | S2.1 43.18,55.28 v43.18,51.75 43.18,48.86 S2.2
N$6
  Bottom 0.254: SG1.- 53.38,58.22 TM1.A
N$7  (via drill 0.6)
  Top 0.254: v74.93,20 74.93,13.02 77.47,10.48 77.47,4.13 76.2,2.86 v23.5,2.86
  Bottom 0.254: U$6.10 74.3,20.64 v74.93,20 | LI7.K v23.5,2.86
N$8
  pour Bottom: 96.52,52.39 95.89,51.12 97.16,51.12
N$10
  Bottom 0.254: IC2.5 62.87,37.15 62.23,37.78 59.69,37.78 59.05,37.15 59.05,35.88 58.42,35.24 54.61,35.24 53.98,35.88 53.98,40.96 55.88,42.86 66.04,42.86 66.67,43.5 R30.1
N$11
  Bottom 0.254: IC2.9 73.03,30.93 QF1.1 C5.1
N$12
  Bottom 0.254: IC2.10 QF1.3 80.64,28.13 C6.1
N$13
  Bottom 0.406: IC2.13 D3.C
N$14
  Bottom 0.254: 91.44,33.97 D2.A 92.71,38.42 93.34,37.78 U$3.2 | D3.A 91.44,33.97 | R8.2 91.44,33.97
N$15
  Bottom 0.254: SR1.3 R20.1
N$16
  Bottom 0.254: POWER_SW.1 JP8.1
N$17
  pour Bottom: 76.2,71.44 76.2,62.55 91.44,62.55 91.44,72.07 76.2,72.07
N$18
  Bottom 0.254: R26.1 SR1.4
N$22
  Bottom 0.254: SR1.2 R25.1
N$23
  Bottom 0.406: R1.P$1 JP15.1
N$24
  Bottom 0.406: R2.P$1 JP14.1
N$25
  Bottom 0.254: R24.1 SR1.1
N$26
  Bottom 0.254: SR1.15 68.9,23.18 68.9,25.08 66.99,26.99 R23.1
N$27  (via drill 0.6)
  Top 0.254: v42.86,23.18 51.75,32.07 86.36,32.07 89.53,35.24 89.53,48.58 v84.14,53.97
  Bottom 0.254: IC2.18 78.11,45.4 80.64,47.94 80.64,52.39 82.23,53.97 v84.14,53.97 JP1.1 | S1.1 42.86,26.71 v42.86,23.18 v42.9,23.14 S1.2
N$31  (via drill 0.6)
  Top 0.254: v45.72,40.32 49.53,40.32 50.16,39.69 80.01,39.69 81.92,41.59 81.92,44.77 v80.64,46.04
  Bottom 0.254: v45.72,40.32 U$5.P1 | JP1.4 99.06,56.83 98.11,57.79 95.89,57.79 93.03,54.93 81.28,54.93 79.38,53.02 79.38,48.58 77.79,46.99 76.83,46.99 76.83,42.54 80.64,42.54 IC2.17 v80.64,46.04
N$35
  Bottom 0.406: R3.P$1 BATT_CONNECT.1
N$36
  Bottom 0.406: R4.P$1 JP12.1
N$37
  Bottom 0.406: R5.P$1 JP11.1
N$38
  Bottom 0.406: R6.P$1 JP10.1
N$40
  Bottom 0.254: R27.1 SR1.5
N$41  (via drill 0.6)
  Top 0.254: v85.72,42.23 85.72,41.59 82.55,38.42 52.07,38.42 48.9,35.24 v46.35,35.24
  Bottom 0.254: v46.35,35.24 U$5.P3 | v85.72,42.23 IC2.15
N$42
  Bottom 0.254: R21.1 SR1.7
N$44
  Bottom 0.254: R22.1 SR1.6
N$51
  Bottom 0.254: Q1.B 63.5,53.02 R30.2
N$52  (via drill 0.6)
  Top 0.254: v52.07,47.94 62.87,47.94 v63.18,48.26
  Bottom 0.254: SG1.+ 50.88,49.21 v52.07,47.94 | v63.18,48.26 Q1.C
OE
  Bottom 0.254: SR1.13 65.41,14.92 65.41,11.75 66.67,10.48 67.94,10.48 69.22,9.21 69.22,4.76 71.12,2.86 88.9,2.86 93.34,7.3 93.34,12.07 SR2.13 89.22,15.88 88.27,16.83 88.27,28.26 90.17,30.16 93.98,30.16 R9.2 94.61,32.07 U$3.3
RESET  (via drill 0.6)
  Top 0.254: v52.7,40.96 76.83,40.96 76.83,47.31 | 76.83,47.31 76.83,47.94 v78.11,49.21 | 76.83,47.31 v85.72,47.31
  Bottom 0.254: IC2.1 v52.7,40.96 | v78.11,49.21 R31.2 79.69,55.56 92.71,55.56 96.2,59.05 JP1.5 | v85.72,47.31 90.17,47.31 D2.C
SEG_A  (via drill 0.6)
  Top 0.254: v21.59,27.62 v21.59,40.32 v21.59,53.02 21.59,54.29 15.56,54.29 v13.97,55.88
  Bottom 0.254: L7S1.7 v21.59,53.02 | L7S2.7 v21.59,40.32 | R27.2 25.4,14.29 21.59,18.1 v21.59,27.62 L7S3.7 13.97,25.08 LI6.A_R LI7.A_R | v13.97,55.88 13.02,54.93 13.02,48.58 LI2.A_R 13.02,46.67 13.02,35.24 LI4.A_R
SEG_B  (via drill 0.6)
  Top 0.254: v22.54,55.56 v22.54,42.86 v22.54,30.16 | v11.11,23.5 11.11,29.21 | 11.11,29.21 v10.16,30.16 | v10.16,51.75 v18.41,51.75 | 11.11,29.21 14.92,29.21 15.24,28.89 v18.41,28.89
  Bottom 0.254: L7S1.6 v22.54,55.56 22.54,51.75 v18.41,51.75 | 18.41,30.16 v22.54,30.16 22.54,18.73 25.72,15.56 48.58,15.56 R26.2 | 18.41,30.16 L7S3.6 | L7S2.6 v22.54,42.86 | v18.41,28.89 18.41,30.16 | LI4.A_G v10.16,30.16 | LI2.A_G v10.16,51.75 | v11.11,23.5 10.16,22.54 LI6.A_G LI7.A_G
SEG_C  (via drill 0.6)
  Top 0.254: v27.3,27.62 v27.3,40.32 v27.3,53.02 | v18.41,39.05 v9.21,39.05
  Bottom 0.254: v27.3,53.02 L7S1.4 | L7S3.4 v27.3,27.62 27.3,18.73 29.21,16.83 46.04,16.83 47.62,18.42 47.62,20 49.53,21.91 R25.2 | L7S2.4 v27.3,40.32 27.3,39.05 v18.41,39.05 | LI2.A_B 8.57,47.62 9.21,46.99 v9.21,39.05 9.21,35.24 LI4.A_B 9.21,33.34 9.21,26.67 8.26,25.72 LI6.A_B 6.99,19.69 6.99,15.56 LI7.A_B
SEG_D  (via drill 0.6)
  Top 0.254: v28.26,47.94 v28.26,35.24 v28.26,22.54
  Bottom 0.254: L7S1.2 v28.26,47.94 | L7S3.2 v28.26,22.54 28.26,18.73 29.53,17.46 45.72,17.46 46.99,18.73 46.99,21.91 49.53,24.45 R24.2 | L7S2.2 v28.26,35.24 28.26,36.51 14.92,36.51 | 14.92,36.51 14.92,28.58 LI5.A_R | 14.92,36.51 14.92,40.01 LI3.A_R 14.92,41.91 14.92,53.34 LI1.A_R
SEG_DP  (via drill 0.6)
  Top 0.254: v26.35,55.56 v26.35,42.86 v26.35,30.16
  Bottom 0.254: L7S1.5 v26.35,55.56 | L7S3.5 v26.35,30.16 26.35,17.46 27.62,16.19 46.67,16.19 R20.2 | L7S2.5 v26.35,42.86
SEG_E  (via drill 0.6)
  Top 0.254: v29.21,45.4 v29.21,32.7 v29.21,20 | v18.41,44.13 v11.11,44.13
  Bottom 0.254: L7S1.1 v29.21,45.4 29.21,44.13 v18.41,44.13 | v29.21,32.7 L7S2.1 | v29.21,20 L7S3.1 33.66,18.1 45.4,18.1 46.35,19.05 46.35,23.81 R23.2 | LI1.A_G 10.79,53.66 11.11,53.66 v11.11,44.13 11.11,42.54 LI3.A_G 11.11,40.01 11.11,28.58 LI5.A_G
SEG_F  (via drill 0.6)
  Top 0.254: v20.64,22.54 v20.64,34.61 v20.64,47.94 19.37,49.21 v8.26,49.21 | v8.26,32.7 13.97,32.7 15.24,33.97 v18.41,33.97
  Bottom 0.254: L7S1.9 v20.64,47.94 | L7S3.9 v20.64,22.54 20.64,16.83 25.72,11.75 R22.2 | L7S2.9 18.41,35.24 | 18.41,35.24 22.23,35.24 v20.64,34.61 | 6.99,32.7 6.99,40.01 7.94,40.96 LI3.A_B | 6.99,32.7 6.99,28.89 LI5.A_B | 6.99,32.7 v8.26,32.7 | v18.41,33.97 18.41,35.24 | v8.26,49.21 LI1.A_B
SEG_G  (via drill 0.6)
  Top 0.254: v19.68,45.4 v19.68,32.7 v19.68,20
  Bottom 0.254: L7S1.10 v19.68,45.4 | L7S3.10 v19.68,20 19.68,15.56 26.04,9.21 R21.2 | L7S2.10 v19.68,32.7
SERIAL_RX
  Bottom 0.254: R7.1 74.3,42.86 70.48,40.96 59.05,40.96 57.78,39.69 IC2.3
SERIAL_TX
  Bottom 0.254: U$1.1 93.38,59.09 93.34,57.15 92.39,56.2 77.5,56.23 77.44,56.23 74.93,58.74 73.03,58.74 71.75,57.47 71.75,43.5 70.48,42.23 56.52,42.23 55.24,40.96 IC2.2
SHCP
  Bottom 0.254: SR1.11 69.85,14.29 76.2,14.29 76.2,21.91 78.11,25.08 82.55,25.08 | 82.55,25.08 82.55,32.07 IC2.11 | SR2.11 83.82,16.51 83.82,23.81 82.55,25.08
STCP1
  Bottom 0.254: SR1.12 70.17,17.78 70.17,21.27 70.8,21.91 73.98,21.91 74.61,22.54 74.61,27.31 73.03,28.89 61.59,28.89 61.59,33.97 62.23,34.61 64.14,34.61 65.41,35.88 IC2.6
STCP2
  Bottom 0.254: SR2.12 84.45,18.42 84.45,32.7 IC2.12